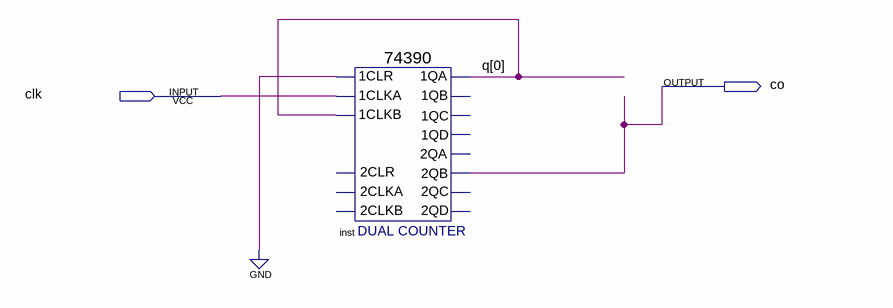
[diagram p0: schematic sheet]
// Quartus schematic mx.bdf as structural Verilog: 1 symbols, 2 pins
module mx (
  input  clk,
  output co
);

  wire [0:0] q;

  \74390  inst (
    .\1CLR (1'b0), .\1CLKA (clk), .\1CLKB (q[0]), .\1QA (q[0]), .\2QB (co));  // open: 2CLKA, 2CLR, 2CLKB, 1QB, 1QC, 1QD, 2QA, 2QC, 2QD
endmodule
